# EAGLE schematic untitled (EAGLE 7.4.0)
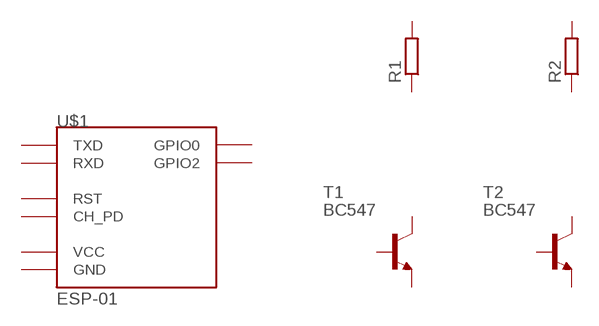
[diagram p0: schematic, sheet 1]

## Parts
R1  R-EU_0204/5  [0204/5]
R2  R-EU_0204/5  [0204/5]
T1  BC547  [TO92]
T2  BC547  [TO92]
U$1  ESP-01  [ESP-01]
Unconnected: R1.1 R1.2 R2.1 R2.2 T1.1(E) T1.2(B) T1.3(C) T2.1(E) T2.2(B) T2.3(C) U$1.CH_PD U$1.GND U$1.GPIO0 U$1.GPIO2 U$1.RST U$1.RX(RXD) U$1.TX(TXD) U$1.VCC

## Library data of the parts
R1 R2 = rcl:R-EU_: RESISTOR, European symbol
T1 T2 = transistor:BC547: NPN TRANSISTOR
U$1 = esp8266modules:ESP-01: ESP8266 Wifi Module ESP-01; DIMENSIONS: 14.3 x 24.8 mm; PINS: 8; PITCH: 0.1" / 2.54 mm